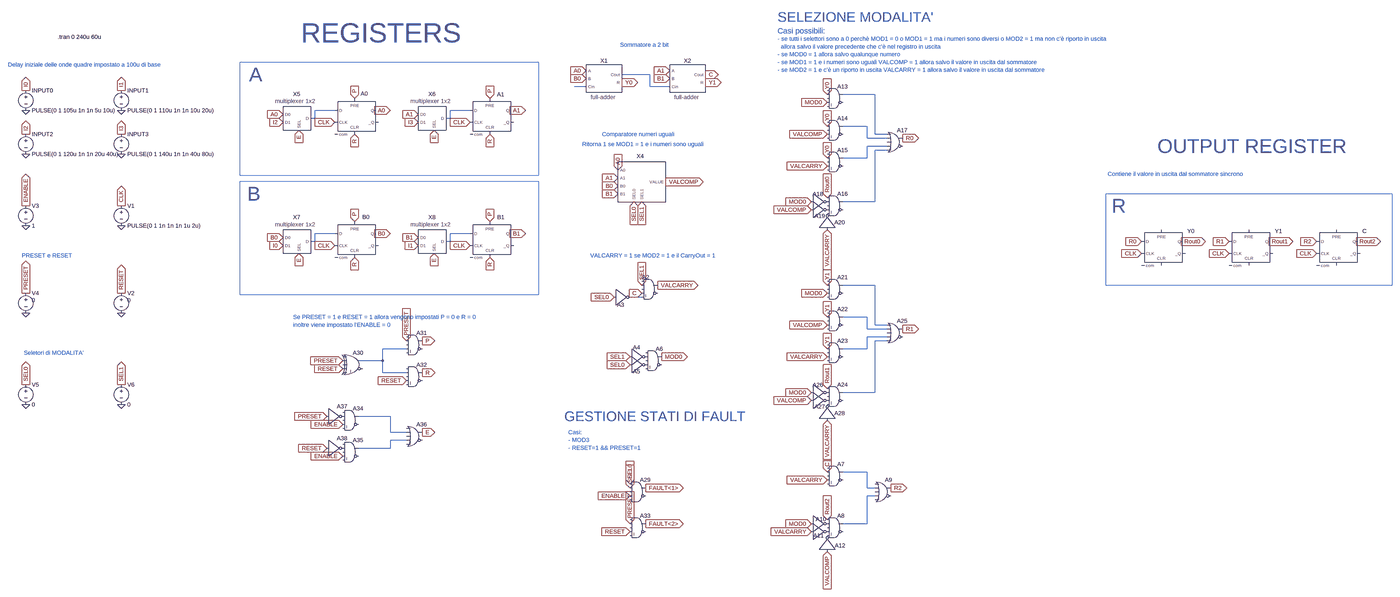
[diagram p0: schematic synchronous_adder.asc, whole sheet]
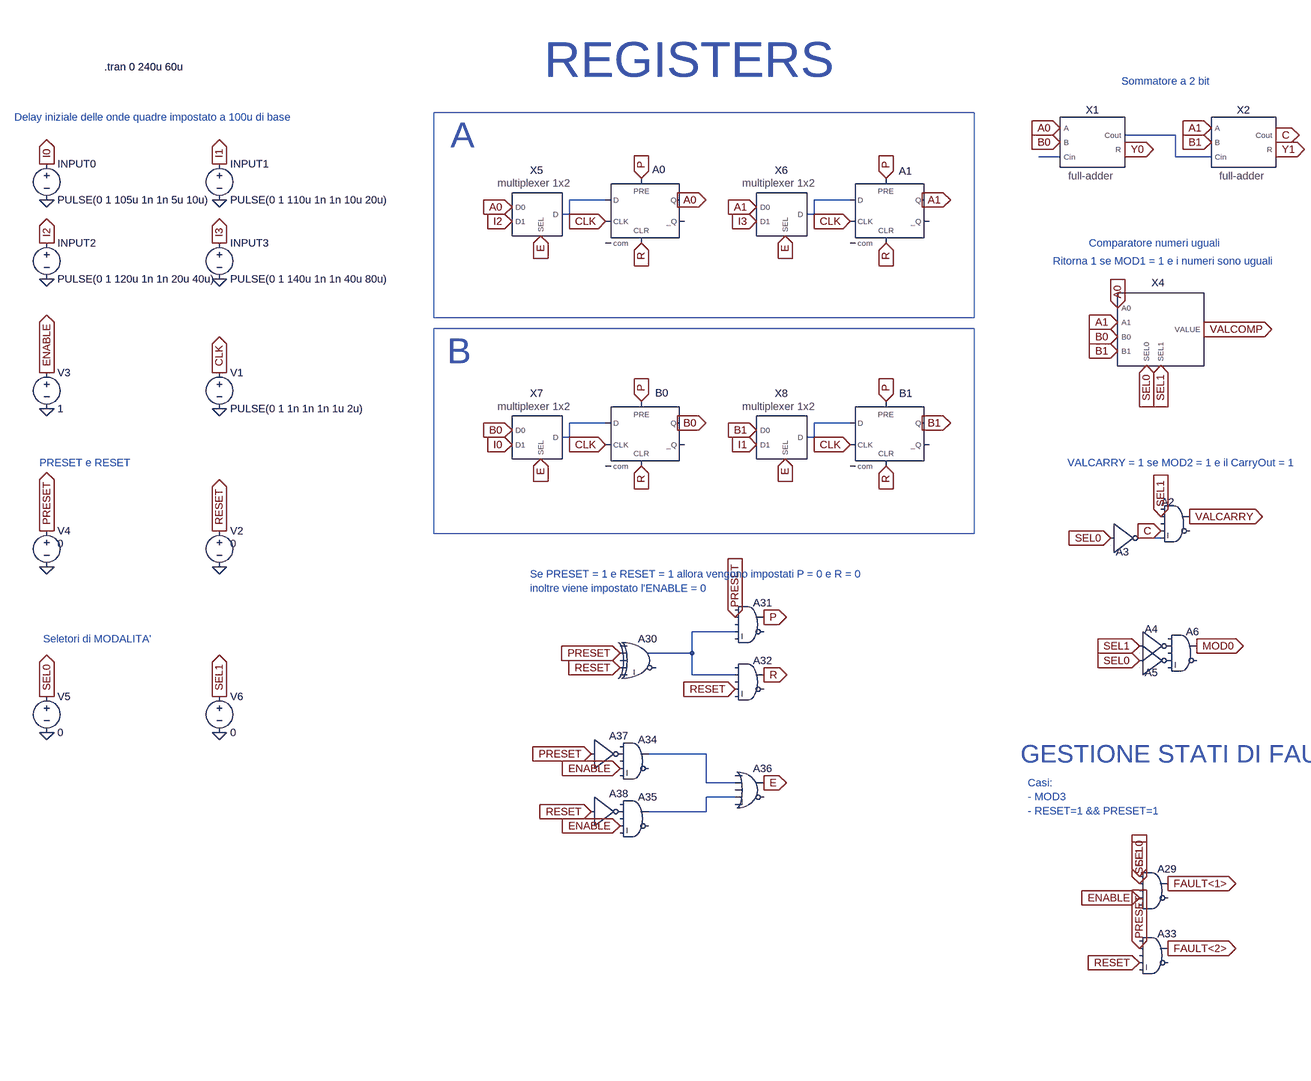
[diagram p1: schematic synchronous_adder.asc, part, row 1 of 1, column 1 of 2]
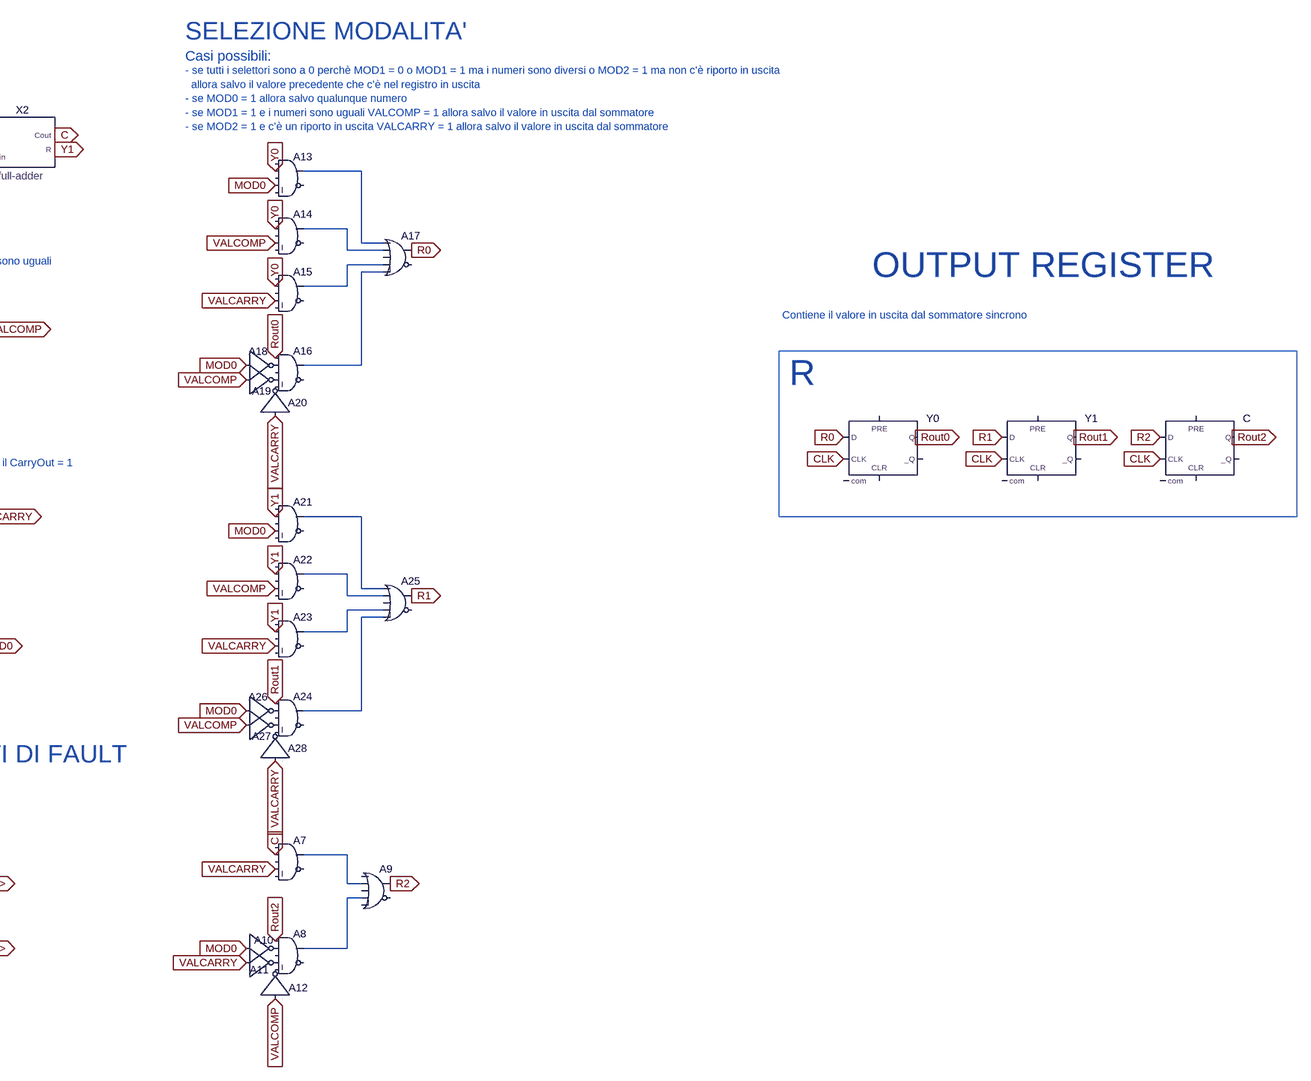
[diagram p2: schematic synchronous_adder.asc, part, row 1 of 1, column 2 of 2]
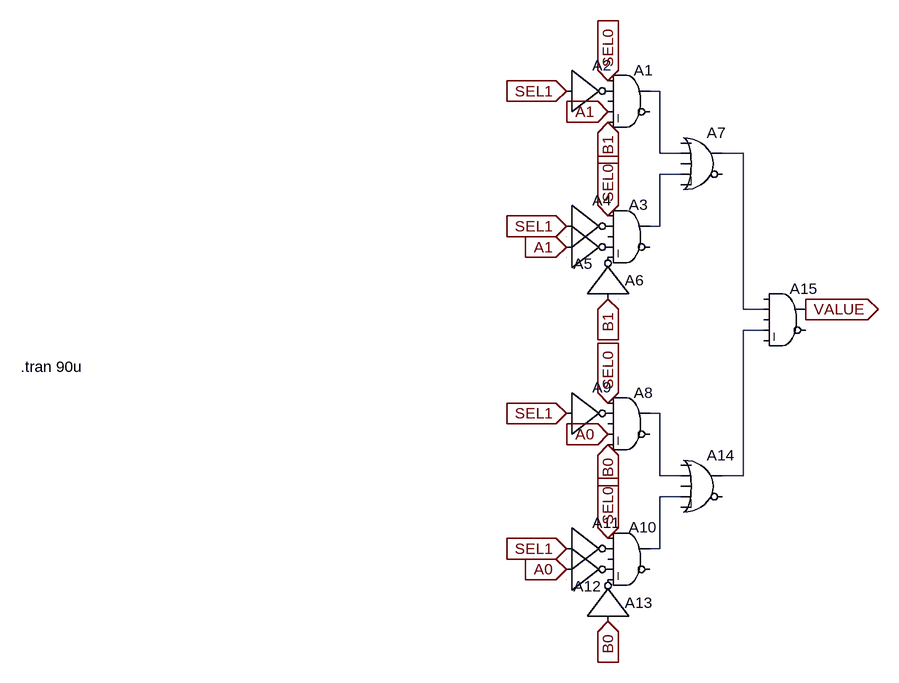
[diagram p3: sub-circuit comparator.asc]
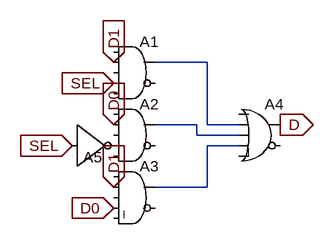
[diagram p4: sub-circuit multiplexer_1x2.asc]
synchronous_adder.asc, the LTspice schematic file:
Version 4
SHEET 1 6160 2280
WIRE 1440 -256 1328 -256
WIRE 1184 -208 1136 -208
WIRE 1440 -208 1440 -256
WIRE 1520 -208 1440 -208
WIRE 2592 -176 2464 -176
WIRE 48 -112 -32 -112
WIRE 592 -112 512 -112
WIRE -32 -80 -32 -112
WIRE -32 -80 -48 -80
WIRE 512 -80 512 -112
WIRE 512 -80 496 -80
WIRE 2560 -48 2464 -48
WIRE 2592 -16 2592 -176
WIRE 2640 -16 2592 -16
WIRE 2560 0 2560 -48
WIRE 2640 0 2560 0
WIRE 2640 32 2560 32
WIRE 2640 48 2592 48
WIRE 2560 80 2560 32
WIRE 2560 80 2464 80
WIRE 2592 256 2592 48
WIRE 2592 256 2464 256
WIRE 48 384 -32 384
WIRE 592 384 512 384
WIRE -32 416 -32 384
WIRE -32 416 -48 416
WIRE 512 416 512 384
WIRE 512 416 496 416
WIRE 2592 592 2464 592
WIRE 1408 640 1360 640
WIRE 2560 720 2464 720
WIRE 2592 752 2592 592
WIRE 2640 752 2592 752
WIRE 2560 768 2560 720
WIRE 2640 768 2560 768
WIRE 2640 800 2560 800
WIRE 2640 816 2592 816
WIRE 336 848 240 848
WIRE 2560 848 2560 800
WIRE 2560 848 2464 848
WIRE 240 896 240 848
WIRE 240 896 144 896
WIRE 240 944 240 896
WIRE 336 944 240 944
WIRE 2592 1024 2592 816
WIRE 2592 1024 2464 1024
WIRE 272 1120 144 1120
WIRE 272 1184 272 1120
WIRE 336 1184 272 1184
WIRE 336 1216 272 1216
WIRE 272 1248 272 1216
WIRE 272 1248 144 1248
WIRE 2560 1344 2464 1344
WIRE 2560 1408 2560 1344
WIRE 2592 1408 2560 1408
WIRE 2592 1440 2560 1440
WIRE 2560 1552 2560 1440
WIRE 2560 1552 2464 1552
FLAG -912 352 0
FLAG -912 272 CLK
IOPIN -912 272 Out
FLAG 48 -64 CLK
IOPIN 48 -64 In
FLAG 592 -64 CLK
IOPIN 592 -64 In
FLAG 208 -112 A0
IOPIN 208 -112 Out
FLAG 752 -112 A1
IOPIN 752 -112 Out
FLAG 48 432 CLK
IOPIN 48 432 In
FLAG 592 432 CLK
IOPIN 592 432 In
FLAG 208 384 B0
IOPIN 208 384 Out
FLAG 752 384 B1
IOPIN 752 384 Out
FLAG 1184 -272 A0
IOPIN 1184 -272 In
FLAG 1184 -240 B0
IOPIN 1184 -240 In
FLAG 1328 -224 Y0
IOPIN 1328 -224 Out
FLAG 1664 -224 Y1
IOPIN 1664 -224 Out
FLAG 1520 -272 A1
IOPIN 1520 -272 In
FLAG 1520 -240 B1
IOPIN 1520 -240 In
FLAG 1664 -256 C
IOPIN 1664 -256 Out
FLAG 3664 464 CLK
IOPIN 3664 464 In
FLAG 4016 464 CLK
IOPIN 4016 464 In
FLAG 3664 416 R0
IOPIN 3664 416 In
FLAG 4016 416 R1
IOPIN 4016 416 In
FLAG 4368 464 CLK
IOPIN 4368 464 In
FLAG 4368 416 R2
IOPIN 4368 416 In
FLAG 128 -160 P
IOPIN 128 -160 In
FLAG 128 480 R
IOPIN 128 480 In
FLAG 672 480 R
IOPIN 672 480 In
FLAG 672 -16 R
IOPIN 672 -16 In
FLAG 128 -16 R
IOPIN 128 -16 In
FLAG -1296 352 0
FLAG -912 704 0
FLAG -912 624 RESET
IOPIN -912 624 Out
FLAG -1296 272 ENABLE
IOPIN -1296 272 Out
FLAG -1296 704 0
FLAG -1296 624 PRESET
IOPIN -1296 624 Out
FLAG 672 -160 P
IOPIN 672 -160 In
FLAG 672 336 P
IOPIN 672 336 In
FLAG 128 336 P
IOPIN 128 336 In
FLAG -1296 -192 I0
IOPIN -1296 -192 Out
FLAG -1296 -16 I2
IOPIN -1296 -16 Out
FLAG -912 -192 I1
IOPIN -912 -192 Out
FLAG -912 -16 I3
IOPIN -912 -16 Out
FLAG -1296 -112 0
FLAG -912 -112 0
FLAG -912 64 0
FLAG -1296 64 0
FLAG -160 -64 I2
IOPIN -160 -64 In
FLAG 1312 128 A0
IOPIN 1312 128 In
FLAG 1312 160 A1
IOPIN 1312 160 In
FLAG 1312 192 B0
IOPIN 1312 192 In
FLAG 1312 224 B1
IOPIN 1312 224 In
FLAG -160 -96 A0
IOPIN -160 -96 In
FLAG -96 -32 E
IOPIN -96 -32 In
FLAG 384 -64 I3
IOPIN 384 -64 In
FLAG 384 -96 A1
IOPIN 384 -96 In
FLAG 448 -32 E
IOPIN 448 -32 In
FLAG -160 432 I0
IOPIN -160 432 In
FLAG -160 400 B0
IOPIN -160 400 In
FLAG -96 464 E
IOPIN -96 464 In
FLAG 384 432 I1
IOPIN 384 432 In
FLAG 384 400 B1
IOPIN 384 400 In
FLAG 448 464 E
IOPIN 448 464 In
FLAG 3824 416 Rout0
IOPIN 3824 416 Out
FLAG 4176 416 Rout1
IOPIN 4176 416 Out
FLAG 4528 416 Rout2
IOPIN 4528 416 Out
FLAG 1504 176 VALCOMP
IOPIN 1504 176 Out
FLAG -1296 992 SEL0
IOPIN -1296 992 Out
FLAG -912 992 SEL1
IOPIN -912 992 Out
FLAG 1408 624 C
IOPIN 1408 624 In
FLAG 1472 592 VALCARRY
IOPIN 1472 592 Out
FLAG 1296 640 SEL0
IOPIN 1296 640 In
FLAG 1408 592 SEL1
IOPIN 1408 592 In
FLAG 1408 256 SEL1
IOPIN 1408 256 In
FLAG 1376 256 SEL0
IOPIN 1376 256 In
FLAG 1360 912 SEL0
IOPIN 1360 912 In
FLAG 1360 880 SEL1
IOPIN 1360 880 In
FLAG 1488 880 MOD0
IOPIN 1488 880 Out
FLAG 2400 1344 C
IOPIN 2400 1344 In
FLAG 2400 1376 VALCARRY
IOPIN 2400 1376 In
FLAG 2400 1536 Rout2
IOPIN 2400 1536 In
FLAG 2336 1552 MOD0
IOPIN 2336 1552 In
FLAG 2336 1584 VALCARRY
IOPIN 2336 1584 In
FLAG 2400 1664 VALCOMP
IOPIN 2400 1664 In
FLAG 2656 1408 R2
IOPIN 2656 1408 Out
FLAG 2400 -176 Y0
IOPIN 2400 -176 In
FLAG 2400 -48 Y0
IOPIN 2400 -48 In
FLAG 2400 80 Y0
IOPIN 2400 80 In
FLAG 2400 240 Rout0
IOPIN 2400 240 In
FLAG 2400 -144 MOD0
IOPIN 2400 -144 In
FLAG 2400 -16 VALCOMP
IOPIN 2400 -16 In
FLAG 2400 112 VALCARRY
IOPIN 2400 112 In
FLAG 2336 256 MOD0
IOPIN 2336 256 In
FLAG 2336 288 VALCOMP
IOPIN 2336 288 In
FLAG 2400 368 VALCARRY
IOPIN 2400 368 In
FLAG 2704 0 R0
IOPIN 2704 0 Out
FLAG 2400 592 Y1
IOPIN 2400 592 In
FLAG 2400 720 Y1
IOPIN 2400 720 In
FLAG 2400 848 Y1
IOPIN 2400 848 In
FLAG 2400 1008 Rout1
IOPIN 2400 1008 In
FLAG 2400 624 MOD0
IOPIN 2400 624 In
FLAG 2400 752 VALCOMP
IOPIN 2400 752 In
FLAG 2400 880 VALCARRY
IOPIN 2400 880 In
FLAG 2336 1024 MOD0
IOPIN 2336 1024 In
FLAG 2336 1056 VALCOMP
IOPIN 2336 1056 In
FLAG 2400 1136 VALCARRY
IOPIN 2400 1136 In
FLAG 2704 768 R1
IOPIN 2704 768 Out
FLAG 1360 1392 SEL0
IOPIN 1360 1392 In
FLAG 1360 1408 SEL1
IOPIN 1360 1408 In
FLAG 1360 1440 ENABLE
IOPIN 1360 1440 In
FLAG 1424 1408 FAULT<1>
IOPIN 1424 1408 Out
FLAG 80 896 PRESET
IOPIN 80 896 In
FLAG 80 928 RESET
IOPIN 80 928 In
FLAG 336 816 PRESET
IOPIN 336 816 In
FLAG 336 976 RESET
IOPIN 336 976 In
FLAG 400 816 P
IOPIN 400 816 Out
FLAG 400 944 R
IOPIN 400 944 Out
FLAG 1360 1552 PRESET
IOPIN 1360 1552 In
FLAG 1360 1584 RESET
IOPIN 1360 1584 In
FLAG 1424 1552 FAULT<2>
IOPIN 1424 1552 Out
FLAG -912 1072 0
FLAG -1296 1072 0
FLAG 16 1120 PRESET
IOPIN 16 1120 In
FLAG 16 1248 RESET
IOPIN 16 1248 In
FLAG 80 1280 ENABLE
IOPIN 80 1280 In
FLAG 80 1152 ENABLE
IOPIN 80 1152 In
FLAG 400 1184 E
IOPIN 400 1184 Out
SYMBOL Digital\\dflop 128 -160 R0
WINDOW 0 24 -19 Left 2
SYMATTR InstName A0
SYMBOL Digital\\dflop 672 -160 R0
WINDOW 0 28 -16 Left 2
SYMATTR InstName A1
SYMBOL voltage -912 256 R0
WINDOW 123 0 0 Left 0
WINDOW 39 0 0 Left 0
SYMATTR InstName V1
SYMATTR Value PULSE(0 1 1n 1n 1n 1u 2u)
SYMBOL Digital\\dflop 128 336 R0
WINDOW 0 31 -19 Left 2
SYMATTR InstName B0
SYMBOL Digital\\dflop 672 336 R0
WINDOW 0 29 -18 Left 2
SYMATTR InstName B1
SYMBOL full_adder 1248 -240 R0
SYMATTR InstName X1
SYMBOL full_adder 1584 -240 R0
SYMATTR InstName X2
SYMBOL Digital\\dflop 3744 368 R0
SYMATTR InstName Y0
SYMATTR SpiceLine Td=2u
SYMBOL Digital\\dflop 4096 368 R0
SYMATTR InstName Y1
SYMATTR SpiceLine Td=2u
SYMBOL Digital\\dflop 4448 368 R0
SYMATTR InstName C
SYMATTR SpiceLine Td=2u
SYMBOL voltage -912 608 R0
WINDOW 123 0 0 Left 0
WINDOW 39 0 0 Left 0
WINDOW 3 24 44 Left 2
SYMATTR Value 0
SYMATTR InstName V2
SYMBOL voltage -1296 256 R0
WINDOW 123 0 0 Left 0
WINDOW 39 0 0 Left 0
SYMATTR InstName V3
SYMATTR Value 1
SYMBOL voltage -1296 608 R0
WINDOW 123 0 0 Left 0
WINDOW 39 0 0 Left 0
WINDOW 3 24 44 Left 2
SYMATTR Value 0
SYMATTR InstName V4
SYMBOL voltage -1296 -208 R0
WINDOW 123 0 0 Left 0
WINDOW 39 0 0 Left 0
SYMATTR InstName INPUT0
SYMATTR Value PULSE(0 1 105u 1n 1n 5u 10u)
SYMBOL voltage -1296 -32 R0
WINDOW 123 0 0 Left 0
WINDOW 39 0 0 Left 0
SYMATTR InstName INPUT2
SYMATTR Value PULSE(0 1 120u 1n 1n 20u 40u)
SYMBOL voltage -912 -32 R0
WINDOW 123 0 0 Left 0
WINDOW 39 0 0 Left 0
SYMATTR InstName INPUT3
SYMATTR Value PULSE(0 1 140u 1n 1n 40u 80u)
SYMBOL voltage -912 -208 R0
WINDOW 123 0 0 Left 0
WINDOW 39 0 0 Left 0
SYMATTR InstName INPUT1
SYMATTR Value PULSE(0 1 110u 1n 1n 10u 20u)
SYMBOL comparator 1392 208 R0
WINDOW 0 10 -120 Bottom 2
SYMATTR InstName X4
SYMBOL multiplexer_1x2 -96 -80 R0
WINDOW 0 -9 -82 Bottom 2
SYMATTR InstName X5
SYMBOL multiplexer_1x2 448 -80 R0
WINDOW 0 -9 -82 Bottom 2
SYMATTR InstName X6
SYMBOL multiplexer_1x2 -96 416 R0
WINDOW 0 -9 -82 Bottom 2
SYMATTR InstName X7
SYMBOL multiplexer_1x2 448 416 R0
WINDOW 0 -9 -82 Bottom 2
SYMATTR InstName X8
SYMBOL voltage -1296 976 R0
WINDOW 123 0 0 Left 0
WINDOW 39 0 0 Left 0
SYMATTR InstName V5
SYMATTR Value 0
SYMBOL voltage -912 976 R0
WINDOW 123 0 0 Left 0
WINDOW 39 0 0 Left 0
SYMATTR InstName V6
SYMATTR Value 0
SYMBOL Digital\\and 1440 544 R0
WINDOW 0 -31 16 Left 2
SYMATTR InstName A2
SYMBOL Digital\\inv 1296 576 R0
WINDOW 0 12 95 Left 2
SYMATTR InstName A3
SYMBOL Digital\\inv 1360 816 R0
WINDOW 0 12 26 Left 2
SYMATTR InstName A4
SYMBOL Digital\\inv 1360 848 R0
WINDOW 0 12 91 Left 2
SYMATTR InstName A5
SYMBOL Digital\\and 1456 832 R0
SYMATTR InstName A6
SYMBOL Digital\\and 2432 1296 R0
SYMATTR InstName A7
SYMBOL Digital\\and 2432 1504 R0
SYMATTR InstName A8
SYMBOL Digital\\or 2624 1360 R0
SYMATTR InstName A9
SYMBOL Digital\\inv 2336 1488 R0
WINDOW 0 18 46 Left 2
SYMATTR InstName A10
SYMBOL Digital\\inv 2336 1520 R0
WINDOW 0 8 80 Left 2
SYMATTR InstName A11
SYMBOL Digital\\inv 2336 1664 R270
WINDOW 0 24 94 VRight 2
SYMATTR InstName A12
SYMBOL Digital\\and 2432 -224 R0
SYMATTR InstName A13
SYMBOL Digital\\and 2432 -96 R0
SYMATTR InstName A14
SYMBOL Digital\\and 2432 32 R0
SYMATTR InstName A15
SYMBOL Digital\\and 2432 208 R0
SYMATTR InstName A16
SYMBOL Digital\\or 2672 -48 R0
SYMATTR InstName A17
SYMBOL Digital\\inv 2336 192 R0
WINDOW 0 5 33 Left 2
SYMATTR InstName A18
SYMBOL Digital\\inv 2336 224 R0
WINDOW 0 13 89 Left 2
SYMATTR InstName A19
SYMBOL Digital\\inv 2336 368 R270
WINDOW 0 29 93 VRight 2
SYMATTR InstName A20
SYMBOL Digital\\and 2432 544 R0
SYMATTR InstName A21
SYMBOL Digital\\and 2432 672 R0
SYMATTR InstName A22
SYMBOL Digital\\and 2432 800 R0
SYMATTR InstName A23
SYMBOL Digital\\and 2432 976 R0
SYMATTR InstName A24
SYMBOL Digital\\or 2672 720 R0
SYMATTR InstName A25
SYMBOL Digital\\inv 2336 960 R0
WINDOW 0 5 33 Left 2
SYMATTR InstName A26
SYMBOL Digital\\inv 2336 992 R0
WINDOW 0 13 89 Left 2
SYMATTR InstName A27
SYMBOL Digital\\inv 2336 1136 R270
WINDOW 0 29 93 VRight 2
SYMATTR InstName A28
SYMBOL Digital\\and 1392 1360 R0
SYMATTR InstName A29
SYMBOL Digital\\xor 128 848 R0
SYMATTR InstName A30
SYMBOL Digital\\and 368 768 R0
SYMATTR InstName A31
SYMBOL Digital\\and 368 896 R0
SYMATTR InstName A32
SYMBOL Digital\\and 1392 1504 R0
SYMATTR InstName A33
SYMBOL Digital\\and 112 1072 R0
SYMATTR InstName A34
SYMBOL Digital\\and 112 1200 R0
SYMATTR InstName A35
SYMBOL Digital\\or 368 1136 R0
SYMATTR InstName A36
SYMBOL Digital\\inv 16 1056 R0
SYMATTR InstName A37
SYMBOL Digital\\inv 16 1184 R0
SYMATTR InstName A38
TEXT -296 -256 Left 6 ;A
TEXT -304 224 Left 6 ;B
TEXT -88 -424 Left 7 ;REGISTERS
TEXT 1320 -376 Left 2 ;Sommatore a 2 bit
TEXT 3544 272 Left 6 ;R
TEXT -1168 -408 Left 2 !.tran 0 240u 60u
TEXT -1368 -296 Left 2 ;Delay iniziale delle onde quadre impostato a 100u di base
TEXT -1304 864 Left 2 ;Seletori di MODALITA'
TEXT 1248 -16 Left 2 ;Comparatore numeri uguali
TEXT 1168 24 Left 2 ;Ritorna 1 se MOD1 = 1 e i numeri sono uguali
TEXT 1200 472 Left 2 ;VALCARRY = 1 se MOD2 = 1 e il CarryOut = 1
TEXT 2200 -488 Left 5 ;SELEZIONE MODALITA'
TEXT 2200 -432 Left 3 ;Casi possibili:
TEXT 2200 -400 Left 2 ;- se tutti i selettori sono a 0 perchè MOD1 = 0 o MOD1 = 1 ma i numeri sono diversi o MOD2 = 1 ma non c'è riporto in uscita \n  allora salvo il valore precedente che c'è nel registro in uscita\n- se MOD0 = 1 allora salvo qualunque numero \n- se MOD1 = 1 e i numeri sono uguali VALCOMP = 1 allora salvo il valore in uscita dal sommatore\n- se MOD2 = 1 e c'è un riporto in uscita VALCARRY = 1 allora salvo il valore in uscita dal sommatore
TEXT 1096 1120 Left 5 ;GESTIONE STATI DI FAULT
TEXT 1112 1184 Left 2 ;Casi:\n- MOD3\n- RESET=1 && PRESET=1
TEXT -1312 472 Left 2 ;PRESET e RESET
TEXT -120 720 Left 2 ;Se PRESET = 1 e RESET = 1 allora vengono impostati P = 0 e R = 0\ninoltre viene impostato l'ENABLE = 0
TEXT 3728 32 Left 6 ;OUTPUT REGISTER
TEXT 3528 144 Left 2 ;Contiene il valore in uscita dal sommatore sincrono
RECTANGLE Normal 868 150 -334 -306
RECTANGLE Normal 868 630 -334 174
RECTANGLE Normal 4672 592 3520 224

comparator.asc, the sub-circuit schematic file:
Version 4
SHEET 1 928 972
WIRE 384 64 368 64
WIRE 384 160 384 64
WIRE 416 160 384 160
WIRE 512 160 480 160
WIRE 416 192 384 192
WIRE 384 272 384 192
WIRE 384 272 368 272
WIRE 512 400 512 160
WIRE 544 400 512 400
WIRE 544 432 512 432
WIRE 384 560 368 560
WIRE 384 656 384 560
WIRE 416 656 384 656
WIRE 512 656 512 432
WIRE 512 656 480 656
WIRE 416 688 384 688
WIRE 384 768 384 688
WIRE 384 768 368 768
FLAG 304 96 A1
IOPIN 304 96 In
FLAG 304 112 B1
IOPIN 304 112 In
FLAG 240 64 SEL1
IOPIN 240 64 In
FLAG 608 400 VALUE
IOPIN 608 400 Out
FLAG 304 48 SEL0
IOPIN 304 48 In
FLAG 240 272 SEL1
IOPIN 240 272 In
FLAG 304 256 SEL0
IOPIN 304 256 In
FLAG 240 304 A1
IOPIN 240 304 In
FLAG 304 384 B1
IOPIN 304 384 In
FLAG 304 592 A0
IOPIN 304 592 In
FLAG 304 608 B0
IOPIN 304 608 In
FLAG 240 560 SEL1
IOPIN 240 560 In
FLAG 304 544 SEL0
IOPIN 304 544 In
FLAG 240 768 SEL1
IOPIN 240 768 In
FLAG 304 752 SEL0
IOPIN 304 752 In
FLAG 240 800 A0
IOPIN 240 800 In
FLAG 304 880 B0
IOPIN 304 880 In
SYMBOL Digital\\and 336 16 R0
SYMATTR InstName A1
SYMBOL Digital\\inv 240 0 R0
SYMATTR InstName A2
SYMBOL Digital\\and 336 224 R0
WINDOW 0 0 15 Left 2
SYMATTR InstName A3
SYMBOL Digital\\inv 240 208 R0
SYMATTR InstName A4
SYMBOL Digital\\inv 240 240 R0
WINDOW 0 11 90 Left 2
SYMATTR InstName A5
SYMBOL Digital\\inv 240 384 R270
WINDOW 0 29 90 VRight 2
SYMATTR InstName A6
SYMBOL Digital\\or 448 112 R0
SYMATTR InstName A7
SYMBOL Digital\\and 336 512 R0
SYMATTR InstName A8
SYMBOL Digital\\inv 240 496 R0
SYMATTR InstName A9
SYMBOL Digital\\and 336 720 R0
WINDOW 0 0 15 Left 2
SYMATTR InstName A10
SYMBOL Digital\\inv 240 704 R0
SYMATTR InstName A11
SYMBOL Digital\\inv 240 736 R0
WINDOW 0 11 90 Left 2
SYMATTR InstName A12
SYMBOL Digital\\inv 240 880 R270
WINDOW 0 29 90 VRight 2
SYMATTR InstName A13
SYMBOL Digital\\or 448 608 R0
SYMATTR InstName A14
SYMBOL Digital\\and 576 352 R0
SYMATTR InstName A15
TEXT -600 488 Left 2 !.tran 90u

multiplexer_1x2.asc, the sub-circuit schematic file:
Version 4
SHEET 1 880 680
WIRE 272 48 192 48
WIRE 256 144 192 144
WIRE 272 144 272 48
WIRE 320 144 272 144
WIRE 256 160 256 144
WIRE 320 160 256 160
WIRE 320 176 272 176
WIRE 272 240 272 176
WIRE 272 240 192 240
FLAG 384 144 D
IOPIN 384 144 Out
FLAG 64 176 SEL
IOPIN 64 176 In
FLAG 128 80 SEL
IOPIN 128 80 In
FLAG 128 144 D0
IOPIN 128 144 In
FLAG 128 272 D0
IOPIN 128 272 In
FLAG 128 48 D1
IOPIN 128 48 In
FLAG 128 240 D1
IOPIN 128 240 In
SYMBOL Digital\\and 160 0 R0
SYMATTR InstName A1
SYMBOL Digital\\and 160 96 R0
SYMATTR InstName A2
SYMBOL Digital\\and 160 192 R0
SYMATTR InstName A3
SYMBOL Digital\\or 352 96 R0
SYMATTR InstName A4
SYMBOL Digital\\inv 64 112 R0
WINDOW 0 17 82 Left 2
SYMATTR InstName A5

The netlist it stands for:
* synchronous_adder.asc
A0 N004 0 CLK P R 0 A0 0 DFLOP
A1 N005 0 CLK P R 0 A1 0 DFLOP
V1 CLK 0 PULSE(0 1 1n 1n 1n 1u 2u)
A§B0 N009 0 CLK P R 0 B0 0 DFLOP
A§B1 N010 0 CLK P R 0 B1 0 DFLOP
XX1 A0 B0 N002 N001 Y0 full_adder  ; pins A B Cin Cout R
XX2 A1 B1 N001 C Y1 full_adder  ; pins A B Cin Cout R
A§Y0 R0 0 CLK 0 0 0 Rout0 0 DFLOP Td=2u
A§Y1 R1 0 CLK 0 0 0 Rout1 0 DFLOP Td=2u
A§C R2 0 CLK 0 0 0 Rout2 0 DFLOP Td=2u
V2 RESET 0 0
V3 ENABLE 0 1
V4 PRESET 0 0
V§INPUT0 I0 0 PULSE(0 1 105u 1n 1n 5u 10u)
V§INPUT2 I2 0 PULSE(0 1 120u 1n 1n 20u 40u)
V§INPUT3 I3 0 PULSE(0 1 140u 1n 1n 40u 80u)
V§INPUT1 I1 0 PULSE(0 1 110u 1n 1n 10u 20u)
XX4 A0 A1 B0 B1 SEL0 SEL1 VALCOMP comparator
XX5 A0 I2 E N004 multiplexer_1x2
XX6 A1 I3 E N005 multiplexer_1x2
XX7 B0 I0 E N009 multiplexer_1x2
XX8 B1 I1 E N010 multiplexer_1x2
V5 SEL0 0 0
V6 SEL1 0 0
A2 0 SEL1 0 C N012 0 VALCARRY 0 AND
A3 SEL0 0 0 0 0 N012 0 0 BUF
A4 SEL1 0 0 0 0 P001 0 0 BUF
A5 SEL0 0 0 0 0 P002 0 0 BUF
A6 0 P001 0 P002 0 0 MOD0 0 AND
A7 0 C 0 VALCARRY 0 0 N019 0 AND
A8 Rout2 P003 0 P004 P005 0 N020 0 AND
A9 0 N019 0 N020 0 0 R2 0 OR
A10 MOD0 0 0 0 0 P003 0 0 BUF
A11 VALCARRY 0 0 0 0 P004 0 0 BUF
A12 VALCOMP 0 0 0 0 P005 0 0 BUF
A13 0 Y0 0 MOD0 0 0 N003 0 AND
A14 0 Y0 0 VALCOMP 0 0 N006 0 AND
A15 0 Y0 0 VALCARRY 0 0 N007 0 AND
A16 Rout0 P006 0 P007 P008 0 N008 0 AND
A17 N003 N006 0 N007 N008 0 R0 0 OR
A18 MOD0 0 0 0 0 P006 0 0 BUF
A19 VALCOMP 0 0 0 0 P007 0 0 BUF
A20 VALCARRY 0 0 0 0 P008 0 0 BUF
A21 0 Y1 0 MOD0 0 0 N011 0 AND
A22 0 Y1 0 VALCOMP 0 0 N013 0 AND
A23 0 Y1 0 VALCARRY 0 0 N014 0 AND
A24 Rout1 P009 0 P010 P011 0 N015 0 AND
A25 N011 N013 0 N014 N015 0 R1 0 OR
A26 MOD0 0 0 0 0 P009 0 0 BUF
A27 VALCOMP 0 0 0 0 P010 0 0 BUF
A28 VALCARRY 0 0 0 0 P011 0 0 BUF
A29 SEL0 SEL1 0 ENABLE 0 0 FAULT<1> 0 AND
A30 0 PRESET 0 RESET 0 0 N016 0 XOR
A31 0 PRESET 0 N016 0 0 P 0 AND
A32 0 N016 0 RESET 0 0 R 0 AND
A33 0 PRESET 0 RESET 0 0 FAULT<2> 0 AND
A34 0 P012 0 ENABLE 0 0 N017 0 AND
A35 0 P013 0 ENABLE 0 0 N018 0 AND
A36 0 N017 0 N018 0 0 E 0 OR
A37 PRESET 0 0 0 0 P012 0 0 BUF
A38 RESET 0 0 0 0 P013 0 0 BUF

* block symbol definitions
.subckt comparator A0 A1 B0 B1 SEL0 SEL1 VALUE
A1 SEL0 P001 0 A1 B1 0 N001 0 AND
A2 SEL1 0 0 0 0 P001 0 0 BUF
A3 SEL0 P002 0 P003 P004 0 N003 0 AND
A4 SEL1 0 0 0 0 P002 0 0 BUF
A5 A1 0 0 0 0 P003 0 0 BUF
A6 B1 0 0 0 0 P004 0 0 BUF
A7 0 N001 0 N003 0 0 N002 0 OR
A8 SEL0 P005 0 A0 B0 0 N005 0 AND
A9 SEL1 0 0 0 0 P005 0 0 BUF
A10 SEL0 P006 0 P007 P008 0 N006 0 AND
A11 SEL1 0 0 0 0 P006 0 0 BUF
A12 A0 0 0 0 0 P007 0 0 BUF
A13 B0 0 0 0 0 P008 0 0 BUF
A14 0 N005 0 N006 0 0 N004 0 OR
A15 0 N002 0 N004 0 0 VALUE 0 AND
.tran 90u
.ends comparator

.subckt multiplexer_1x2 D0 D1 SEL D
A1 0 D1 0 SEL 0 0 N001 0 AND
A2 0 D0 0 P001 0 0 N002 0 AND
A3 0 D1 0 D0 0 0 N003 0 AND
A4 0 N001 N002 N003 0 0 D 0 OR
A5 SEL 0 0 0 0 P001 0 0 BUF
.ends multiplexer_1x2

* A
* B
* REGISTERS
* Sommatore a 2 bit
* R
.tran 0 240u 60u
* Delay iniziale delle onde quadre impostato a 100u di base
* Seletori di MODALITA'
* Comparatore numeri uguali
* Ritorna 1 se MOD1 = 1 e i numeri sono uguali
* VALCARRY = 1 se MOD2 = 1 e il CarryOut = 1
* SELEZIONE MODALITA'
* Casi possibili:
* - se tutti i selettori sono a 0 perchè MOD1 = 0 o MOD1 = 1 ma i numeri sono diversi o MOD2 = 1 ma non c'è riporto in uscita
*   allora salvo il valore precedente che c'è nel registro in uscita
* - se MOD0 = 1 allora salvo qualunque numero
* - se MOD1 = 1 e i numeri sono uguali VALCOMP = 1 allora salvo il valore in uscita dal sommatore
* - se MOD2 = 1 e c'è un riporto in uscita VALCARRY = 1 allora salvo il valore in uscita dal sommatore
* GESTIONE STATI DI FAULT
* Casi:
* - MOD3
* - RESET=1 && PRESET=1
* PRESET e RESET
* Se PRESET = 1 e RESET = 1 allora vengono impostati P = 0 e R = 0
* inoltre viene impostato l'ENABLE = 0
* OUTPUT REGISTER
* Contiene il valore in uscita dal sommatore sincrono
.backanno
.end